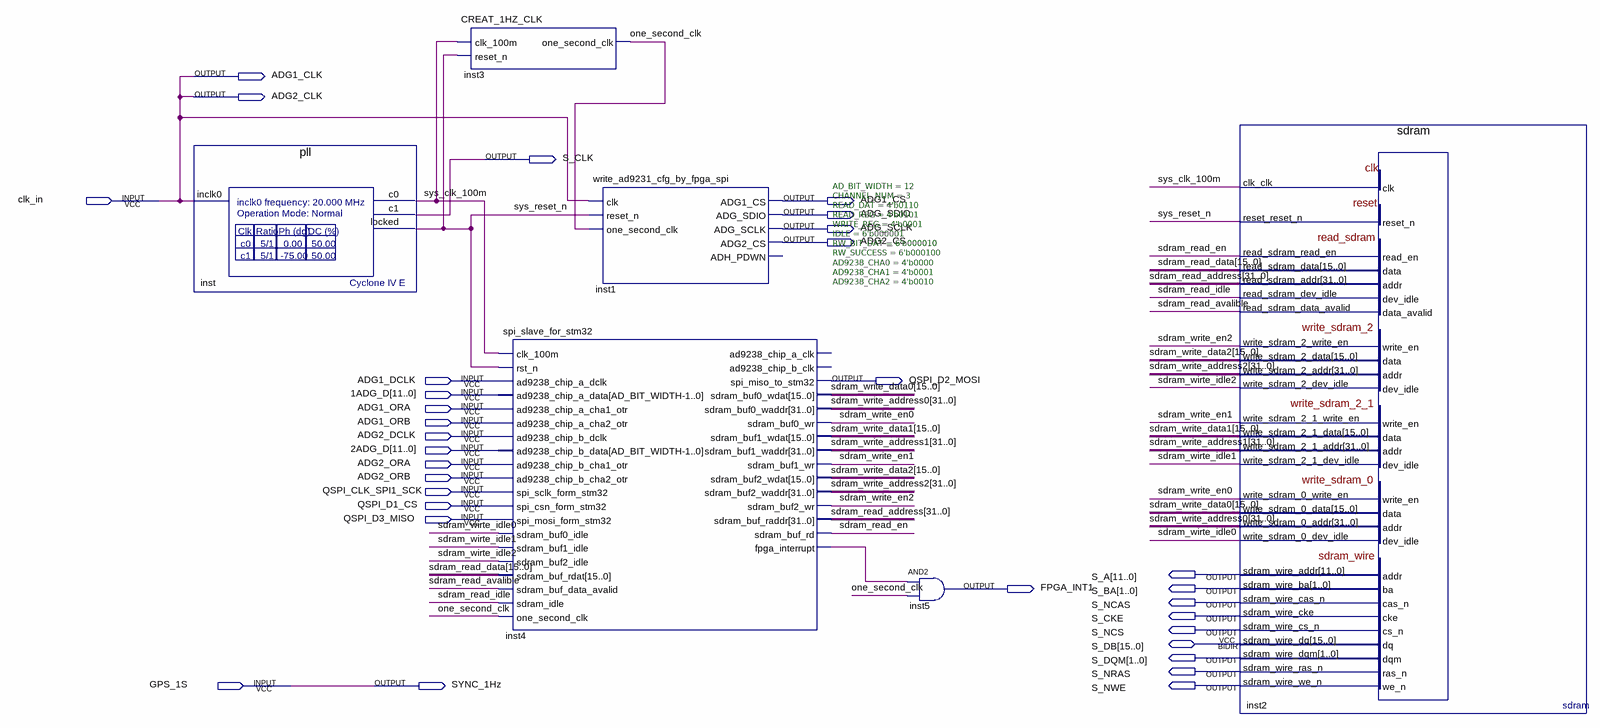
[diagram p0: schematic sheet]
// Quartus schematic 123456789 - 副本.bdf as structural Verilog: 6 symbols, 32 pins
module \123456789_-_副本  (
  input  clk_in,
  input  ADG1_DCLK,
  input  [11:0] \1ADG_D ,
  input  ADG1_ORA,
  input  ADG1_ORB,
  input  ADG2_DCLK,
  input  [11:0] \2ADG_D ,
  input  ADG2_ORA,
  input  ADG2_ORB,
  input  QSPI_CLK_SPI1_SCK,
  input  QSPI_D1_CS,
  input  QSPI_D3_MISO,
  input  GPS_1S,
  inout  [15:0] S_DB,
  output ADG1_CLK,
  output ADG2_CLK,
  output S_CLK,
  output ADG1_CS,
  output ADG_SDIO,
  output ADG_SCLK,
  output ADG2_CS,
  output QSPI_D2_MOSI,
  output [11:0] S_A,
  output FPGA_INT1,
  output [1:0] S_BA,
  output S_NCAS,
  output S_CKE,
  output S_NCS,
  output [1:0] S_DQM,
  output S_NRAS,
  output SYNC_1Hz,
  output S_NWE
);

  wire inst4_fpga_interrupt, one_second_clk, sdram_read_avalible, sdram_read_en, sdram_read_idle,
       sdram_wirte_idle0, sdram_wirte_idle1, sdram_wirte_idle2, sdram_write_en0, sdram_write_en1,
       sdram_write_en2, sys_clk_100m, sys_reset_n;
  wire [15:0] sdram_read_data, sdram_write_data0, sdram_write_data1, sdram_write_data2;
  wire [31:0] sdram_read_address, sdram_write_address0, sdram_write_address1, sdram_write_address2;

  pll inst (.inclk0(clk_in), .c0(sys_clk_100m), .c1(S_CLK), .locked(sys_reset_n));
  CREAT_1HZ_CLK inst3 (.clk_100m(sys_clk_100m), .reset_n(sys_reset_n), .one_second_clk(one_second_clk));
  spi_slave_for_stm32 #(.AD_BIT_WIDTH(12), .CHANNEL_NUM(3), .READ_DAT(4'b0110), .READ_REG(4'b0101), .WRITE_REG(4'b0001), .IDLE(6'b000001), .RW_BIT_DAT(6'b000010), .RW_SUCCESS(6'b000100), .AD9238_CHA0(4'b0000), .AD9238_CHA1(4'b0001), .AD9238_CHA2(4'b0010)) inst4 (
    .clk_100m(sys_clk_100m), .rst_n(sys_reset_n), .ad9238_chip_a_dclk(ADG1_DCLK),
    .ad9238_chip_a_data(\1ADG_D ), .ad9238_chip_a_cha1_otr(ADG1_ORA), .ad9238_chip_a_cha2_otr(ADG1_ORB),
    .ad9238_chip_b_dclk(ADG2_DCLK), .ad9238_chip_b_data(\2ADG_D ), .ad9238_chip_b_cha1_otr(ADG2_ORA),
    .ad9238_chip_b_cha2_otr(ADG2_ORB), .spi_sclk_form_stm32(QSPI_CLK_SPI1_SCK),
    .spi_csn_form_stm32(QSPI_D1_CS), .spi_mosi_form_stm32(QSPI_D3_MISO), .sdram_buf0_idle(sdram_wirte_idle0),
    .sdram_buf1_idle(sdram_wirte_idle1), .sdram_buf2_idle(sdram_wirte_idle2),
    .sdram_buf_rdat(sdram_read_data), .sdram_buf_data_avalid(sdram_read_avalible),
    .sdram_idle(sdram_read_idle), .one_second_clk(one_second_clk), .spi_miso_to_stm32(QSPI_D2_MOSI),
    .sdram_buf0_wdat(sdram_write_data0), .sdram_buf0_waddr(sdram_write_address0),
    .sdram_buf0_wr(sdram_write_en0), .sdram_buf1_wdat(sdram_write_data1),
    .sdram_buf1_waddr(sdram_write_address1), .sdram_buf1_wr(sdram_write_en1),
    .sdram_buf2_wdat(sdram_write_data2), .sdram_buf2_waddr(sdram_write_address2),
    .sdram_buf2_wr(sdram_write_en2), .sdram_buf_raddr(sdram_read_address), .sdram_buf_rd(sdram_read_en),
    .fpga_interrupt(inst4_fpga_interrupt));  // open: ad9238_chip_a_clk, ad9238_chip_b_clk
  write_ad9231_cfg_by_fpga_spi inst1 (
    .clk(clk_in), .reset_n(sys_reset_n), .one_second_clk(one_second_clk), .ADG1_CS(ADG1_CS),
    .ADG_SCLK(ADG_SCLK), .ADG2_CS(ADG2_CS), .ADG_SDIO(ADG_SDIO));  // open: ADH_PDWN
  and inst5 (FPGA_INT1, inst4_fpga_interrupt, one_second_clk);
  sdram inst2 (
    .clk_clk(sys_clk_100m), .reset_reset_n(sys_reset_n), .read_sdram_read_en(sdram_read_en),
    .read_sdram_addr(sdram_read_address), .write_sdram_2_write_en(sdram_write_en2),
    .write_sdram_2_data(sdram_write_data2), .write_sdram_2_addr(sdram_write_address2),
    .write_sdram_2_1_write_en(sdram_write_en1), .write_sdram_2_1_data(sdram_write_data1),
    .write_sdram_2_1_addr(sdram_write_address1), .write_sdram_0_write_en(sdram_write_en0),
    .write_sdram_0_data(sdram_write_data0), .write_sdram_0_addr(sdram_write_address0),
    .read_sdram_data(sdram_read_data), .read_sdram_dev_idle(sdram_read_idle),
    .read_sdram_data_avalid(sdram_read_avalible), .write_sdram_2_dev_idle(sdram_wirte_idle2),
    .write_sdram_2_1_dev_idle(sdram_wirte_idle1), .write_sdram_0_dev_idle(sdram_wirte_idle0),
    .sdram_wire_addr(S_A), .sdram_wire_ba(S_BA), .sdram_wire_cas_n(S_NCAS), .sdram_wire_cke(S_CKE),
    .sdram_wire_cs_n(S_NCS), .sdram_wire_dqm(S_DQM), .sdram_wire_ras_n(S_NRAS), .sdram_wire_we_n(S_NWE),
    .sdram_wire_dq(S_DB));

  assign ADG1_CLK = clk_in;
  assign ADG2_CLK = clk_in;
  assign SYNC_1Hz = GPS_1S;
endmodule
